# EAGLE design train (EAGLE 9.5.2)
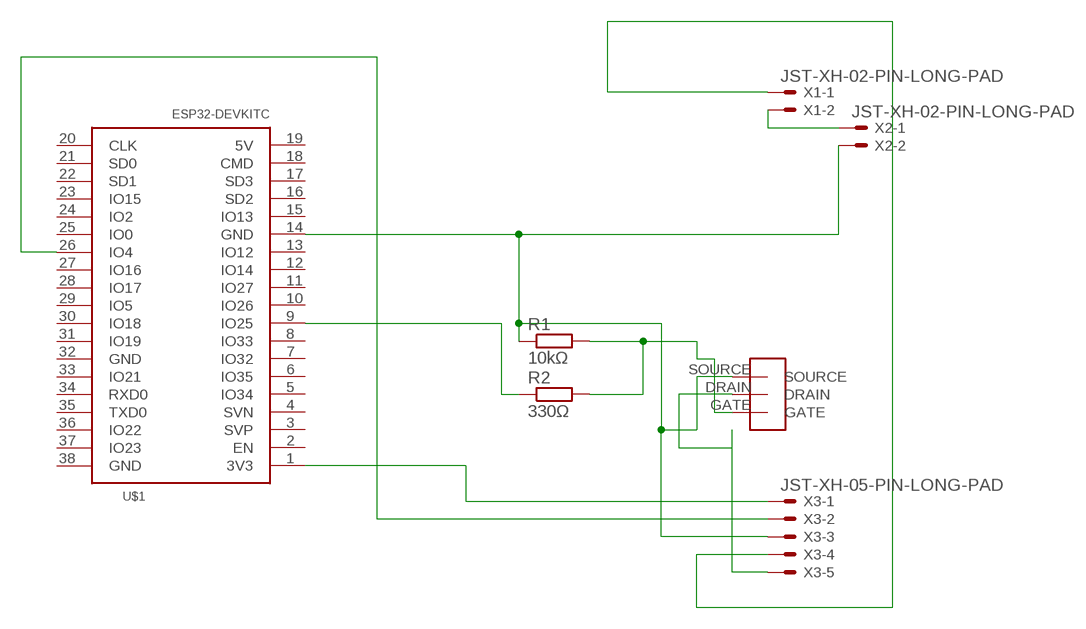
[diagram p0: schematic, sheet 1]

## Parts
FET1  FET  [FET]
R1  10kΩ  R-EU_0207/10  [0207/10]
R2  330Ω  R-EU_0207/10  [0207/10]
U$1  ESP32DEVKITC  [ESP32-DEVKITC]
X1  JST-XH-02-PIN-LONG-PAD  [JST-XH-02-PACKAGE-LONG-PAD]
X2  JST-XH-02-PIN-LONG-PAD  [JST-XH-02-PACKAGE-LONG-PAD]
X3  JST-XH-05-PIN-LONG-PAD  [JST-XH-05-PACKAGE-LONG-PAD]

## Nets
N$1: X1.1 X3.4
N$2: FET1.SOURCE R1.1 U$1.14(GND) X2.2 X3.3
N$4: FET1.GATE R1.2 R2.2
N$5: R2.1 U$1.9(IO25)
N$6: X1.2 X2.1
N$7: U$1.1(3V3) X3.1
N$8: U$1.26(IO4) X3.2
N$9: FET1.DRAIN X3.5
Unconnected: U$1.2(EN) U$1.3(SVP) U$1.4(SVN) U$1.5(IO34) U$1.6(IO35) U$1.7(IO32) U$1.8(IO33) U$1.10(IO26) U$1.11(IO27) U$1.12(IO14) U$1.13(IO12) U$1.15(IO13) U$1.16(SD2) U$1.17(SD3) U$1.18(CMD) U$1.19(5V) U$1.20(CLK) U$1.21(SD0) U$1.22(SD1) U$1.23(IO15) U$1.24(IO2) U$1.25(IO0) U$1.27(IO16) U$1.28(IO17) U$1.29(IO5) U$1.30(IO18) U$1.31(IO19) U$1.32(GND) U$1.33(IO21) U$1.34(RXD0) U$1.35(TXD0) U$1.36(IO22) U$1.37(IO23) U$1.38(GND)

## Library data of the parts
FET1 = FET:FET
R1 R2 = resistor:R-EU_: RESISTOR, European symbol
U$1 = ESP32-DEVKITC:ESP32DEVKITC
X1 X2 = Rembrandt Electronics - JST XH Connectors v1-0:JST-XH-02-PIN: JST XH Connector 2 Pin Wire to board connector. Pitch: 2,54 mm, (0.100") Number of pins: 2 Created by Rembrandt Electronics www.rembrandtelectronics.com
X3 = Rembrandt Electronics - JST XH Connectors v1-0:JST-XH-05-PIN: JST XH Connector 2 Pin Wire to board connector. Pitch: 2,54 mm, (0.100") Number of pins: 5 Created by Rembrandt Electronics www.rembrandtelectronics.com

## Board
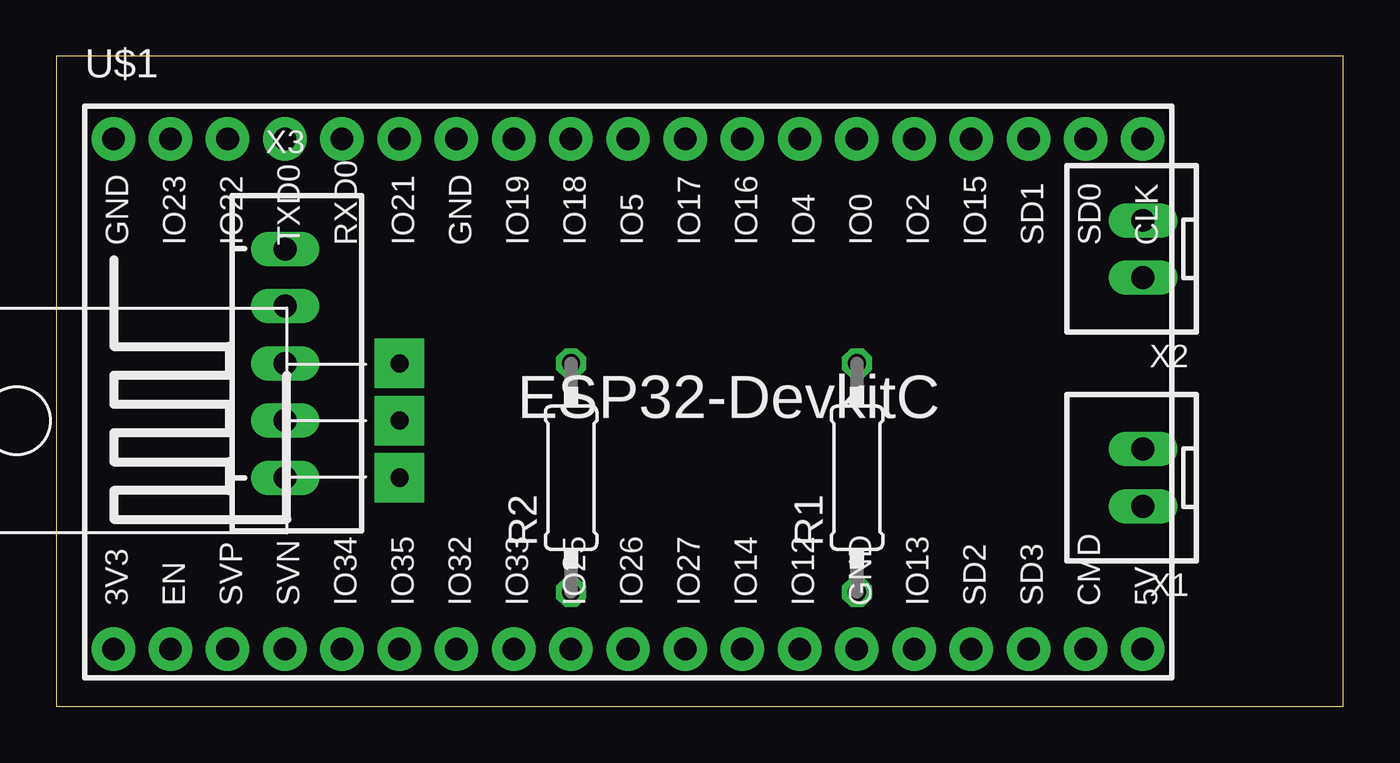
[diagram p1: board, top side]
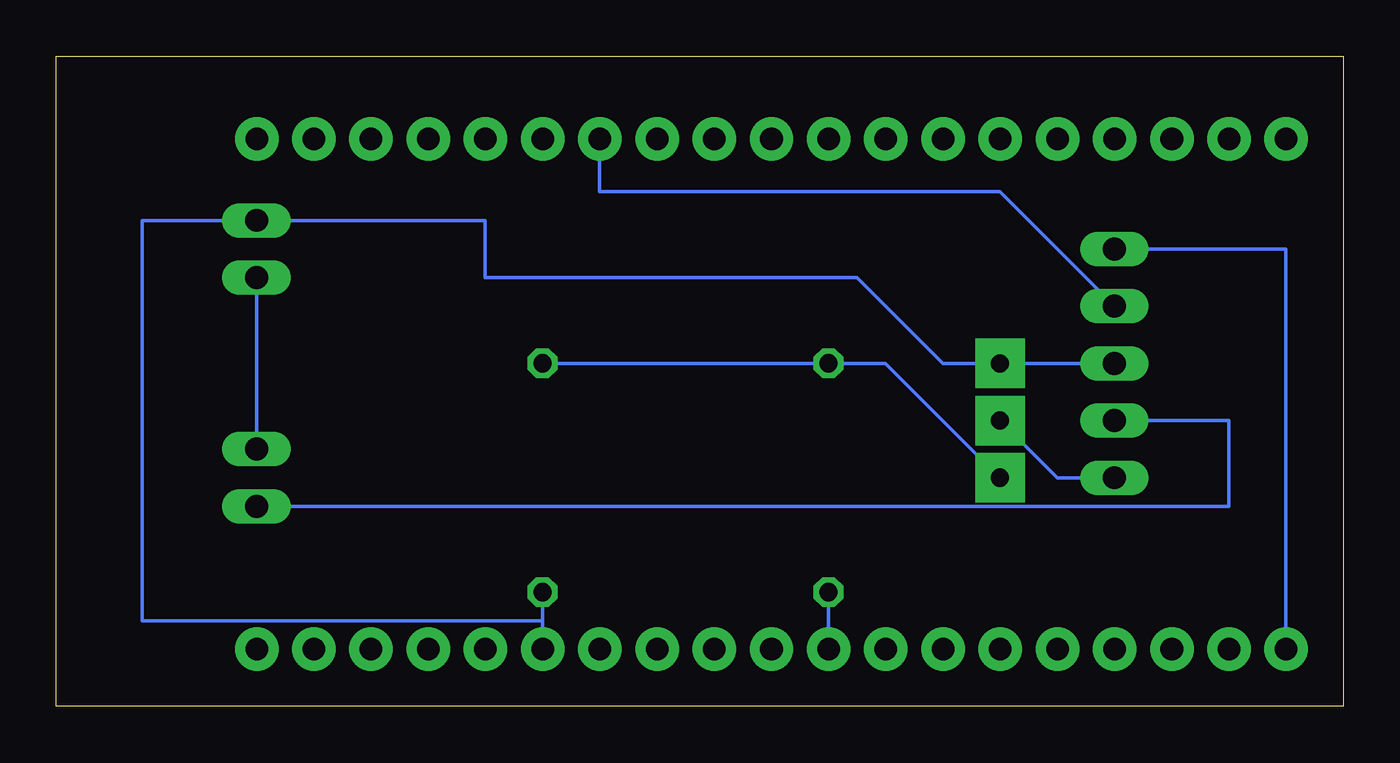
[diagram p2: board, bottom side, seen from below]

Size 57.15 x 28.88 mm. Coordinates in mm from the lower left corner, seen from the top.
Outline: 0,0 57.15,0 57.15,28.88 0,28.88 0,0
Copper layers (1*16): Top 0.035mm / dielectric 1.5mm / Bottom 0.035mm
Design rules "default": minimum track width 6mil, minimum drill 0.35mm, track to track 6mil, track to pad 6mil, pad to pad 6mil, via to via 6mil, smd to smd 6mil, copper to edge 40mil, drill to drill 6mil, minimum pad ring 10mil, minimum via ring 8mil, stop-mask expansion 4mil, vias tented up to drill 0mil, thermal gap 10mil

### Footprints (pad centres in the part's own frame; a part is rotated, then mirrored left to right if it is on the bottom)
FET = drill 0.8 pad 2.2 square: DRAIN 0,0; GATE -2.54,0; SOURCE 2.54,0
0207/10 = drill 0.813 octagon: 1 -5.08,0; 2 5.08,0
ESP32-DEVKITC = drill 1 pad 1.93: 1 -22.87,-11.42; 2 -20.33,-11.42; 3 -17.79,-11.42; 4 -15.25,-11.42; 5 -12.71,-11.42; 6 -10.17,-11.42; 7 -7.63,-11.42; 8 -5.09,-11.42; 9 -2.55,-11.42; 10 -0.01,-11.42; 11 2.53,-11.42; 12 5.07,-11.42; 13 7.61,-11.42; 14 10.15,-11.42; 15 12.69,-11.42; 16 15.23,-11.42; 17 17.77,-11.42; 18 20.31,-11.42; 19 22.85,-11.42; 20 22.85,11.23; 21 20.31,11.23; 22 17.77,11.23; 23 15.23,11.23; 24 12.69,11.23; 25 10.15,11.23; 26 7.61,11.23; 27 5.07,11.23; 28 2.53,11.23; 29 -0.01,11.23; 30 -2.55,11.23; 31 -5.09,11.23; 32 -7.63,11.23; 33 -10.17,11.23; 34 -12.71,11.23; 35 -15.25,11.23; 36 -17.79,11.23; 37 -20.33,11.23; 38 -22.87,11.23
JST-XH-02-PACKAGE-LONG-PAD = drill 1.016 long: 1 -1.27,0; 2 1.27,0
JST-XH-05-PACKAGE-LONG-PAD = drill 1.016 long: 1 -5.08,0; 2 -2.54,0; 3 0,0; 4 2.54,0; 5 5.08,0

### Placement (x,y rotation side)
FET1  15.24,12.7 90 top
R1  35.56,10.16 90 top
R2  22.86,10.16 90 top
U$1  25.4,13.97 0 top
X1  48.26,10.16 90 top
X2  48.26,20.32 90 top
X3  10.16,15.24 270 top

### Tracks (layer width: path | path; a pad name or v marks a point on that pad's centre or on a via)
N$1
  Bottom 0.152: X3.4 5.08,12.7 5.08,8.89 X1.1
N$2
  Bottom 0.152: U$1.14 R1.1 35.56,3.81 53.34,3.81 53.34,21.59 X2.2 38.1,21.59 38.1,19.05 21.59,19.05 17.78,15.24 FET1.SOURCE X3.3
N$4
  Bottom 0.152: FET1.GATE 20.32,15.24 R2.2 R1.2
N$5
  Bottom 0.152: U$1.9 R2.1
N$6
  Bottom 0.152: X2.1 X1.2
N$7
  Bottom 0.152: X3.1 2.54,20.32 U$1.1
N$8
  Bottom 0.152: X3.2 15.24,22.86 33.02,22.86 U$1.26
N$9
  Bottom 0.152: FET1.DRAIN 12.7,10.16 X3.5